# EAGLE design CoinControllerV1 (EAGLE 9.5.1)
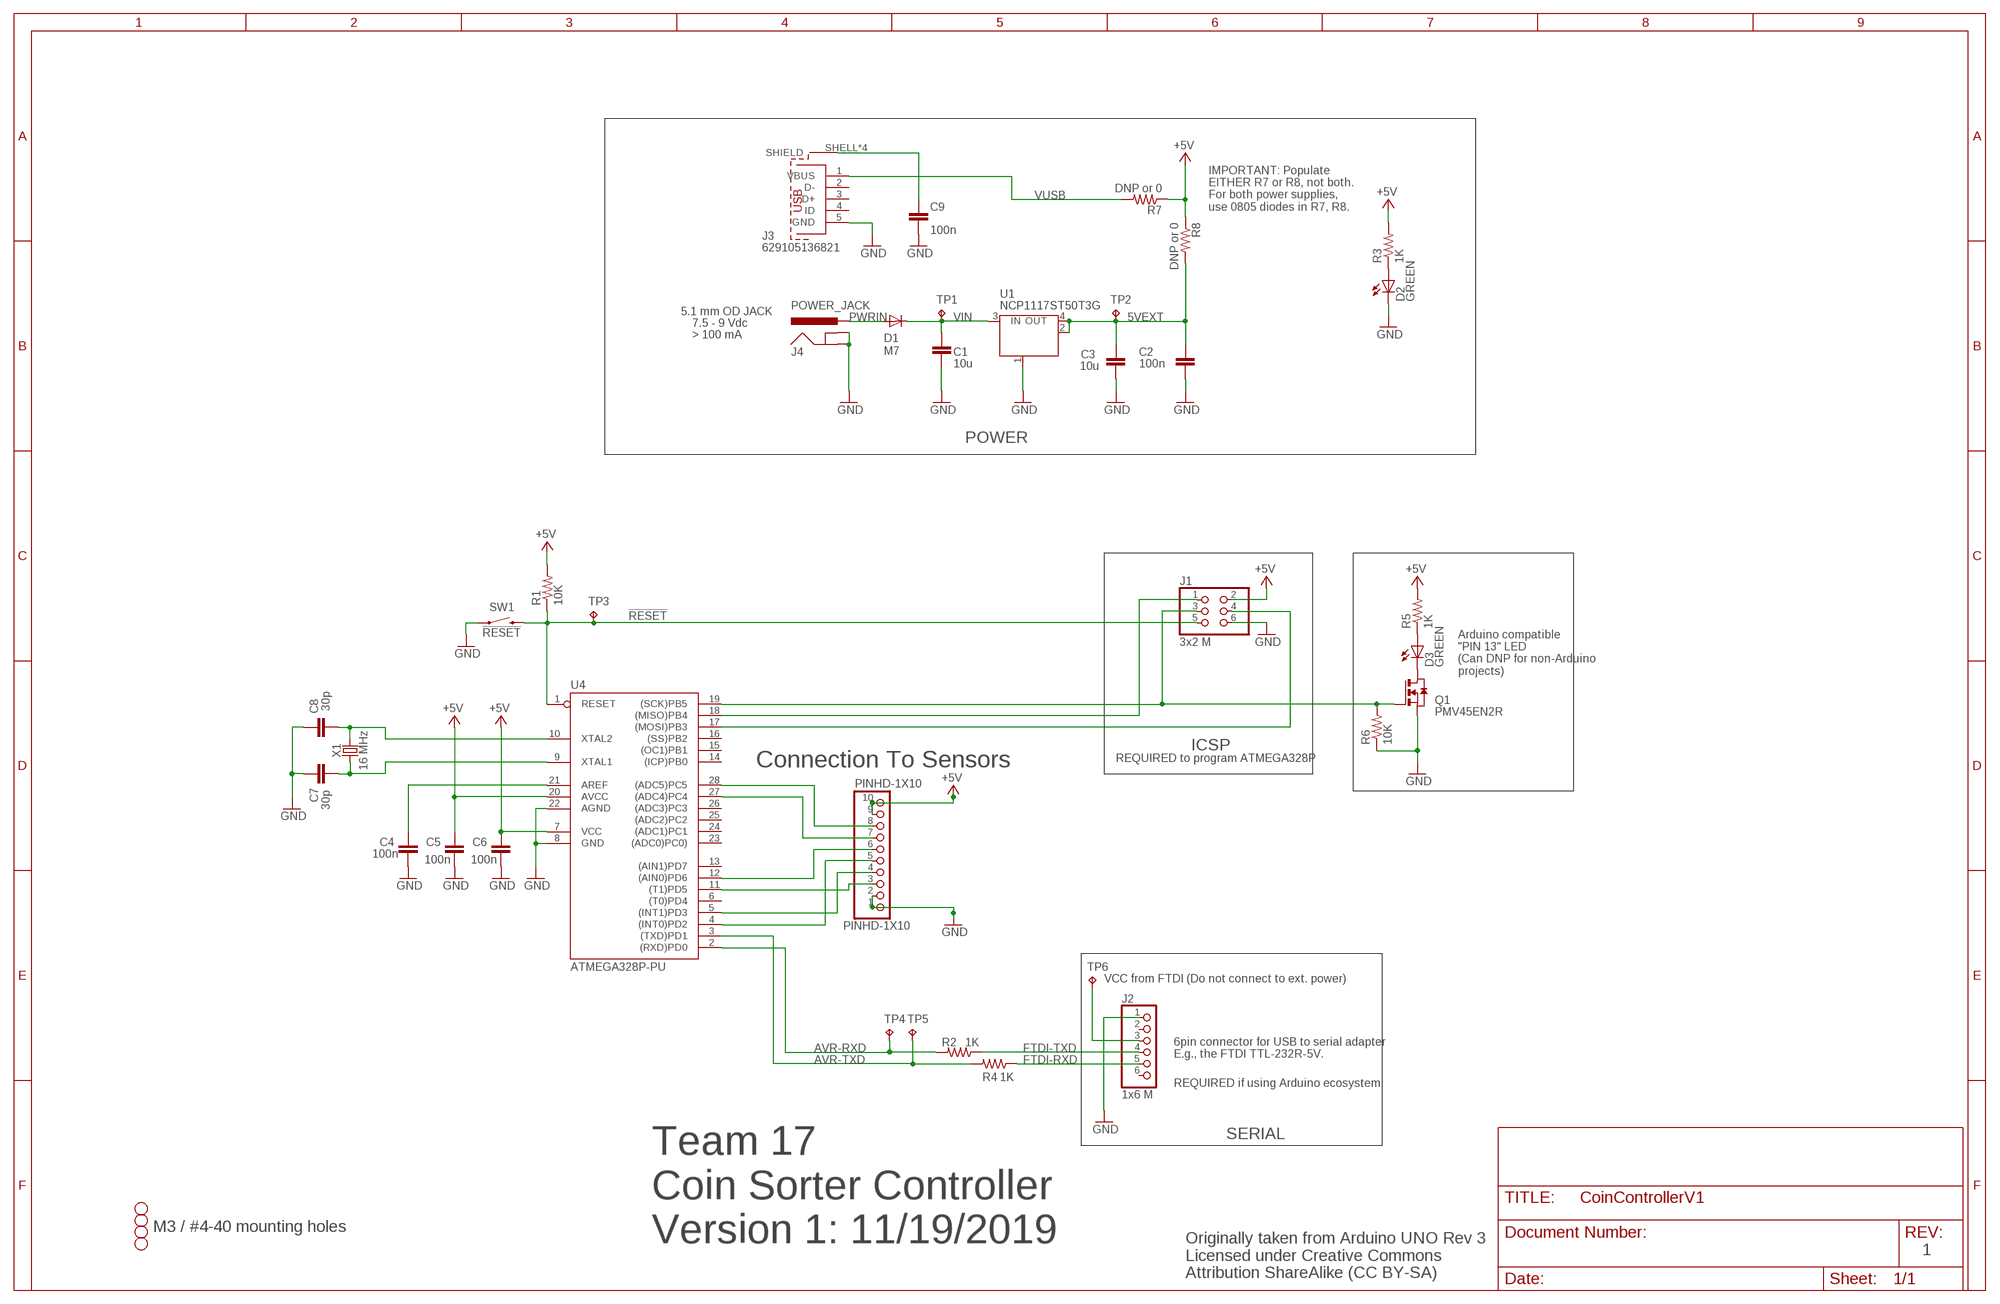
[diagram p0: schematic, sheet 1]

## Parts
C1  10u  C-EUC0805K  [C0805K]
C2  100n  C-EUC0805K  [C0805K]
C3  10u  C-EUC0805K  [C0805K]
C4  100n  C-EUC0805K  [C0805K]
C5  100n  C-EUC0805K  [C0805K]
C6  100n  C-EUC0805K  [C0805K]
C7  30p  C-EUC0805K  [C0805K]
C8  30p  C-EUC0805K  [C0805K]
C9  100n  C-EUC0805K  [C0805K]
D1  M7  DIODE-SMB  [SMB]
D2  GREEN  LEDCHIP-LED0805  [CHIP-LED0805]
D3  GREEN  LEDCHIP-LED0805  [CHIP-LED0805]
H1  STAND-OFF  [STAND-OFF]
H2  STAND-OFF  [STAND-OFF]
H3  STAND-OFF  [STAND-OFF]
H4  STAND-OFF  [STAND-OFF]
J1  3x2 M  PINHD-2X3  [2X03]
J2  1x6 M  PINHD-1X6  [1X06]
J3  629105136821  [629105136821]
J4  POWER_JACK  [POWER_JACK_PTH]
PINHD-1X10  PINHD-1X10  [1X10-BIG]
Q1  PMV45EN2R  NMOSSOT23  [SOT-23]
R1  10K  R-US_R0805  [R0805]
R2  1K  R-US_R0805  [R0805]
R3  1K  R-US_R0805  [R0805]
R4  1K  R-US_R0805  [R0805]
R5  1K  R-US_R0805  [R0805]
R6  10K  R-US_R0805  [R0805]
R7  DNP or 0  R-US_R0805  [R0805]
R8  DNP or 0  R-US_R0805  [R0805]
SW1  !RESET  SWITCH-MOMENTARY-2SMD  [TACTILE_SWITCH_SMD]
TP1  TPPAD1-13  [P1-13]
TP2  TPPAD1-13  [P1-13]
TP3  TPPAD1-13  [P1-13]
TP4  TPPAD1-13  [P1-13]
TP5  TPPAD1-13  [P1-13]
TP6  TPPAD1-13  [P1-13]
U1  NCP1117ST50T3G  MC33269ST-3.3T3  [SOT223]
U4  ATMEGA328P-PU  [DIL28-3]
X1  16 MHz  CRYSTALSMD-HC49UP  [HC49UP]

## Nets
5VEXT: C2.2 C3.1 R8.2 TP2.TP U1.2(OUT) U1.4(OUT)
!RESET: J1.5 R1.1 SW1.3 TP3.TP U4.1(RESET)
+5V: C5.2 C6.2 J1.2 PINHD-1X10.9 PINHD-1X10.10 R1.2 R3.2 R5.2 R7.1 R8.1 U4.7(VCC) U4.20(AVCC)
AVR-RXD: R2.2 TP4.TP U4.2((RXD)PD0)
AVR-TXD: R4.2 TP5.TP U4.3((TXD)PD1)
FTDI-RXD: J2.5 R4.1
FTDI-TXD: J2.4 R2.1
GND: C1.2 C2.1 C3.2 C4.1 C5.1 C6.1 C7.2 C8.2 C9.1 D2.C J1.6 J2.1 J3.5(GND) J4.GND J4.GNDBREAK PINHD-1X10.1 PINHD-1X10.2 Q1.2(S) R6.1 SW1.1 U1.1(GND/ADJ) U4.8(GND) U4.22(AGND)
MISO: J1.1 U4.18((MISO)PB4)
MOSI: J1.4 U4.17((MOSI)PB3)
N$1: C4.2 U4.21(AREF)
N$2: D3.A R5.1
N$3: D2.A R3.1
N$4: D3.C Q1.1(D)
N$5: J2.3 TP6.TP
N$6: C9.2 J3.SHELL1(SHIELD) J3.SHELL2(SHIELD) J3.SHELL3(SHIELD) J3.SHELL(SHIELD)
N$7: PINHD-1X10.5 U4.4((INT0)PD2)
N$8: PINHD-1X10.4 U4.5((INT1)PD3)
N$9: PINHD-1X10.3 U4.11((T1)PD5)
N$10: PINHD-1X10.6 U4.12((AIN0)PD6)
N$11: PINHD-1X10.7 U4.27((ADC4)PC4)
N$12: PINHD-1X10.8 U4.28((ADC5)PC5)
PWRIN: D1.A J4.PWR
SCK: J1.3 Q1.3(G) R6.2 U4.19((SCK)PB5)
VIN: C1.1 D1.C TP1.TP U1.3(IN)
VUSB: J3.1(VBUS) R7.2
XTAL1: C7.1 U4.9(XTAL1) X1.1
XTAL2: C8.1 U4.10(XTAL2) X1.2
Unconnected: J2.2 J2.6 J3.2(D-) J3.3(D+) J3.4(ID) U4.6((T0)PD4) U4.13((AIN1)PD7) U4.14((ICP)PB0) U4.15((OC1)PB1) U4.16((SS)PB2) U4.23((ADC0)PC0)) U4.24((ADC1)PC1) U4.25((ADC2)PC2) U4.26((ADC3)PC3)

## Notes on the sheet
- IMPORTANT: Populate 
  EITHER R7 or R8, not both.
  For both power supplies,
  use 0805 diodes in R7, R8.
- 5.1 mm OD JACK
- 7.5 - 9 Vdc
- > 100 mA
- POWER
- Arduino compatible
  "PIN 13" LED
  (Can DNP for non-Arduino
  projects)
- ICSP
- REQUIRED to program ATMEGA328P
- Connection To Sensors
- VCC from FTDI (Do not connect to ext. power)
- 6pin connector for USB to serial adapter
  E.g., the FTDI TTL-232R-5V.
- REQUIRED if using Arduino ecosystem.
- SERIAL
- M3 / #4-40 mounting holes
- Team 17
  Coin Sorter Controller
  Version 1: 11/19/2019
- 1
- Originally taken from Arduino UNO Rev 3
  Licensed under Creative Commons 
  Attribution ShareAlike (CC BY-SA)

## Library data of the parts
C1 C3 = rcl:C-EU: CAPACITOR, European symbol; MFR: Samsung; MPN: CL21A106KOQNNNG; SPICEPREFIX: C
C2 C4-C6 C9 = rcl:C-EU: CAPACITOR, European symbol; MFR: Samsung; MPN: CL21B104KBCNNNC; SPICEPREFIX: C
C7 = rcl:C-EU: CAPACITOR, European symbol; DESC: CAP CER 30PF 50V C0G/NP0 0805; MFR: Samsung; MPN: CL21C180JBANNNC; SPICEPREFIX: C
C8 = rcl:C-EU: CAPACITOR, European symbol; DESC: CAP CER 30PF 50V C0G/NP0 0805; MFR: Samsung; MPN: CL21C300JBANNNC; SPICEPREFIX: C
D1 = diode:DIODE-: DIODE; MFR: SMC Diode; MPN: 10BQ030TR
D2 D3 = led:LED: LED OSRAM: - CHIPLED LG R971, LG N971, LY N971, LG Q971, LY Q971, LO R971, LY R971 LH N974, LH R974 LS Q976, LO Q976, LY Q976 LO Q996 - Hyper CHIPLED LW Q18S LB Q993, LB Q99A, LB R99A - SideLED LS A670, LO A670, LY A670, LG A670, LP A670 LB A673, LV A673, LT A673, LW A673 LH A674 LY A675 LS A676, LA A676, LO A676, LY A676, LW A676 LS A679, LY A679, LG A679 - Hyper Micro SIDELED® LS Y876, LA Y876, LO Y876, LY Y876 LT Y87S - SmartLED LW L88C, LW L88S LB L89C, LB L89S, LG L890 LS L89K, LO L89K, LY L89K LS L896, LA L896, LO L896, LY L896 - TOPLED LS T670, LO T670, LY T670, LG T670, LP T670 LSG T670, LSP T670, LSY T670, LOP T670, LYG T670 LG T671, LOG T671, LSG T671 LB T673, LV T673, LT T673, LW T673 LH T674 LS T676, LA T676, LO T676, LY T676, LB T676, LH T676, LSB T676, LW T676 LB T67C, LV T67C, LT T67C, LS T67K, LO T67K, LY T67K, LW E67C LS E67B, LA E67B, LO E67B, LY E67B, LB E67C, LV E67C, LT E67C LW T67C LS T679, LY T679, LG T679 LS T770, LO T770, LY T770, LG T770, LP T770 LB T773, LV T773, LT T773, LW T773 LH T774 LS E675, LA E675, LY E675, LS T675 LS T776, LA T776, LO T776, LY T776, LB T776 LHGB T686 LT T68C, LB T68C - Hyper Mini TOPLED® LB M676 - Mini TOPLED Santana® LG M470 LS M47K, LO M47K, LY M47K Source: http://www.osram.convergy.de LUXEON: - LUMILED® LXK2-PW12-R00, LXK2-PW12-S00, LXK2-PW14-U00, LXK2-PW14-V00 LXK2-PM12-R00, LXK2-PM12-S00, LXK2-PM14-U00 LXK2-PE12-Q00, LXK2-PE12-R00, LXK2-PE12-S00, LXK2-PE14-T00, LXK2-PE14-U00 LXK2-PB12-K00, LXK2-PB12-L00, LXK2-PB12-M00, LXK2-PB14-N00, LXK2-PB14-P00, LXK2-PB14-Q00 LXK2-PR12-L00, LXK2-PR12-M00, LXK2-PR14-Q00, LXK2-PR14-R00 LXK2-PD12-Q00, LXK2-PD12-R00, LXK2-PD12-S00 LXK2-PH12-R00, LXK2-PH12-S00 LXK2-PL12-P00, LXK2-PL12-Q00, LXK2-PL12-R00 Source: www.luxeon.com KINGBRIGHT: KA-3528ASYC Source: www.kingbright.com; MFR: Würth Elektronik; MPN: 150080GS75000
H1-H4 = SparkFun-Hardware:STAND-OFF: Stand Off Drill holes for mechanically mounting via screws, standoffs, etc. Note: Use the keepout ring to avoid running the screw head into surrounding components. Variant Overviews STAND-OFF - Mechanical footprint for a #4 phillips button head screw. STAND-OFF-TIGHT - Mechanical footprint for a #4 phillips button head screw, Example SparkFun Products Screw - Phillips Head (1/4", 4-40, 10 pack) <https://www.sparkfun.com/products/10453> (PRT-10453) Screw - Phillips Head (1/2", 4-40, 10 pack) <https://www.sparkfun.com/products/10452> (PRT-10452) Screw - Phillips Head (3/4", 4-40, 10 pack) <https://www.sparkfun.com/products/10451> (PRT-10451) Screw - Phillips Head (1", 4-40, 10 pack) <https://www.sparkfun.com/products/10450> (PRT-10450)
J1 = SmartPrj:PINHD-2X3: PIN HEADER; MFR: Harwin; MPN: M20-9980345
J2 = pinhead:PINHD-1X6: PIN HEADER; MFR: Sullins; MPN: PRPC006SAAN-RC
J3 = Wurth_Elektronik_Electromechanic_Input-Output_Connectors_rev19b:629105136821: WR-COM SMT Horizontal 5 Contacts Micro USB Type B,5 pins=>Code : Con_I-O_COM_MicroUSB_629105136821 <http://katalog.we-online.de/media/images/eican/Con_I-O_COM_MicroUSB_629105136821_pf2.jpg> Details see: http://katalog.we-online.de/en/em/COM_MICRO_SMT_TYPE_B_HORIZONTAL/629105136821?m Created 2014-07-09, Karrer Zheng 2014 (C) Würth Elektronik; MFR: Wurth; MPN: 629105136821
J4 = SparkFun-Connectors:POWER_JACK: Power Jack Connector This is the standard 5.5mm barrel jack for power. The PTH is the most common, proven, reliable, footprint. The Slot footprint only works if the mill layer is transmitted to the PCB fab house so be warned. Here are the connectors we sell at SparkFun: DC Barrel Power Jack/Connector <https://www.sparkfun.com/products/119> (PRT-00119) DC Barrel Power Jack/Connector (SMD) <https://www.sparkfun.com/products/12748> (PRT-12748) DC Barrel Jack Adapter - Breadboard Compatible <https://www.sparkfun.com/products/10811> (PRT-10811) It is used on this SparkFun product (and many, many others): SparkFun RedBoard - Programmed with Arduino <https://www.sparkfun.com/products/12757> (DEV-12757) Also, if you need a mating power supply or connector, please check these out: Wall Adapter Power Supply - 9VDC 650mA <https://www.sparkfun.com/products/298> (TOL-00298) DC Barrel Jack Adapter - Male <https://www.sparkfun.com/products/10287> (PRT-10287); MFR: CUI; MPN: PJ-202A; PROD_ID: CONN-08197
PINHD-1X10 = adafruit:PINHD-1X10: Pin header 1x10 0.1" spacing With round pins
Q1 = zetex:NMOSSOT23: MOS FET; MFR: Nexperia; MPN: PMV45EN2R; OC_FARNELL: unknown; OC_NEWARK: unknown
R1 R6 = rcl:R-US_: RESISTOR, American symbol; MFR: Yageo; MPN: RC0805FR-0710KL; SPICEPREFIX: R
R2-R5 = rcl:R-US_: RESISTOR, American symbol; MFR: Yageo; MPN: RC0805FR-071KL; SPICEPREFIX: R
R7 R8 = rcl:R-US_: RESISTOR, American symbol; MFR: Yageo; MPN: RC0805JR-070RL; SPICEPREFIX: R
SW1 = SparkFun-Electromechanical:SWITCH-MOMENTARY-2: Various NO switches- pushbuttons, reed, etc; DESC: SWITCH TACTILE SPST-NO 0.05A 12V; MFR: C&K; MPN: RS-187R05A2-DS MT RT
TP1-TP6 = testpad:TP: Test pad
U1 = linear:MC33269ST*: Adjustable Output Low Dropout Voltage Regulator 800 mA Source: http://www.onsemi.com/pub/Collateral/MC33269-D.PDF; MFR: ON Semiconductor; MPN: NCP1117ST50T3G
U4 = SmartPrj:ATMEGA328P-: MICROCONTROLLER 4 Kbytes FLASH 128 bytes SRAM 256 bytes EEPROM UART 6-channel 10 bit ADC; MFR: Microchip; MPN: ATMEGA328P-PU
X1 = SparkFun-Clocks:CRYSTAL: Crystals (Generic) These are passive quartz crystals, which can be used as a clock source for a microcontroller. Crystal's are two-terminal devices. They require external "load" capacitors to generate an oscillating signal.; DESC: CRYSTAL 16.000 MHZ 18PF SMD; MFR: ECS; MPN: ECS-160-18-5PX-TR

## Net classes
0 default: width 0.254 mm, clearance 0.254 mm

## Board
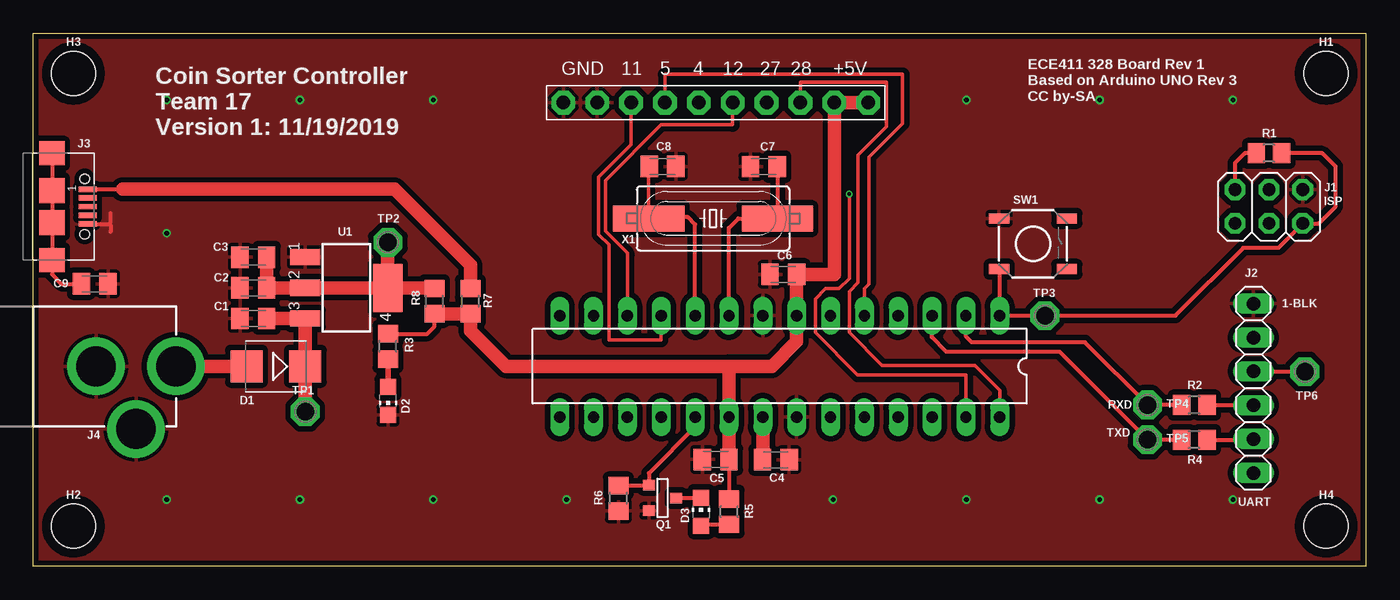
[diagram p1: board, top side]
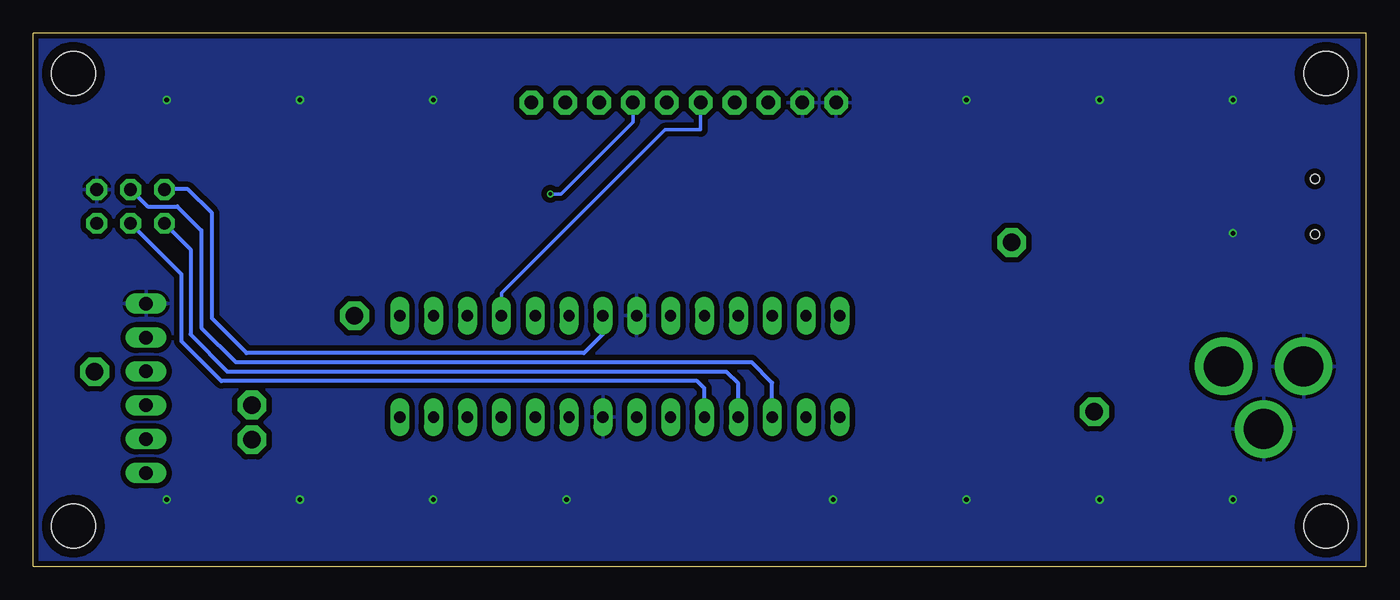
[diagram p2: board, bottom side, seen from below]

Size 100 x 40 mm. Coordinates in mm from the lower left corner, seen from the top.
Outline: 0,0 0,40 100,40 100,0 0,0
Copper layers (1*16): Top 0.035559375mm / dielectric 1.6mm / Bottom 0.035559375mm
Design rules "oshpark-2layer": minimum track width 6mil, minimum drill 10mil, track to track 6mil, track to pad 6mil, pad to pad 6mil, via to via 6mil, smd to smd 6mil, copper to edge 15mil, drill to drill 6mil, minimum pad ring 5mil, minimum via ring 5mil, stop-mask expansion 2.5mil, vias tented up to drill 0mil, thermal gap 10mil

### Footprints (pad centres in the part's own frame; a part is rotated, then mirrored left to right if it is on the bottom)
C0805K = smd 1.3 x 1.6: 1 -1,0; 2 1,0
SMB = smd 2.4 x 2.4: A 2.2,0; C -2.2,0
CHIP-LED0805 = smd 1.2 x 1.2: A 0,-1.05; C 0,1.05
STAND-OFF = hole 3.302: 0,0
2X03 = drill 0.95 pad 1.55 octagon: 1 -2.54,-1.27; 2 -2.54,1.27; 3 0,-1.27; 4 0,1.27; 5 2.54,-1.27; 6 2.54,1.27
1X06 = drill 1.016 long: 1 -6.35,0; 2 -3.81,0; 3 -1.27,0; 4 1.27,0; 5 3.81,0; 6 6.35,0
629105136821 = smd 0.4 x 1.35: 1 -1.3,2.675; 2 -0.65,2.675; 3 0,2.675; 4 0.65,2.675; 5 1.3,2.675 | smd 1.8 x 1.9: SHELL -4,0; SHELL3 4,0 | smd 1.9 x 1.9: SHELL1 -1.2,0; SHELL2 1.2,0 | hole 0.7: -2.075,2.45; 2.075,2.45
POWER_JACK_PTH = drill 2.997 pad 4.318: GND 0,7.7; GNDBREAK 4.7,10.7; PWR 0,13.7
1X10-BIG = drill 1.016 pad 1.778 octagon: 1 -11.43,0; 2 -8.89,0; 3 -6.35,0; 4 -3.81,0; 5 -1.27,0; 6 1.27,0; 7 3.81,0; 8 6.35,0; 9 8.89,0; 10 11.43,0
SOT-23 = smd 0.787 x 0.889: 1 0.025,-1.016; 2 -0.94,1.016; 3 0.991,1.016
R0805 = smd 1.3 x 1.5: 1 -0.95,0; 2 0.95,0
TACTILE_SWITCH_SMD = smd 1.524 x 0.762: 1 -2.54,1.905; 2 2.54,1.905; 3 -2.54,-1.905; 4 2.54,-1.905
P1-13 = drill 1.321 pad 2.159 octagon: TP 0,0
SOT223 = smd 1.219 x 2.235: 1 -2.311,-3.099; 2 0,-3.099; 3 2.311,-3.099 | smd 3.6 x 2.2: 4 0,3.099
DIL28-3 = drill 0.85 pad 1.422 long: 1 -16.51,-3.81; 2 -13.97,-3.81; 3 -11.43,-3.81; 4 -8.89,-3.81; 5 -6.35,-3.81; 6 -3.81,-3.81; 7 -1.27,-3.81; 8 1.27,-3.81; 9 3.81,-3.81; 10 6.35,-3.81; 11 8.89,-3.81; 12 11.43,-3.81; 13 13.97,-3.81; 14 16.51,-3.81; 15 16.51,3.81; 16 13.97,3.81; 17 11.43,3.81; 18 8.89,3.81; 19 6.35,3.81; 20 3.81,3.81; 21 1.27,3.81; 22 -1.27,3.81; 23 -3.81,3.81; 24 -6.35,3.81; 25 -8.89,3.81; 26 -11.43,3.81; 27 -13.97,3.81; 28 -16.51,3.81
HC49UP = smd 5.334 x 1.93: 1 -4.826,0; 2 4.826,0

### Placement (x,y rotation side)
C1  16.5,18.6 180 top
C2  16.5,20.9 0 top
C3  16.5,23.2 180 top
C4  55.7,8 180 top
C5  51.19,8.01 0 top
C6  56.27,21.91 0 top
C7  54.8,30 180 top
C8  47.2,30.01 0 top
C9  4.6,21.2 180 top
D1  18.2,15 180 top
D2  26.6,12.4 180 top
D3  50.1,4.1 0 top
H1  97,37 0 top
H2  3,3 0 top
H3  3,37 0 top
H4  97,3 0 top
J1  92.7,27 0 top
J2  91.54,13.35 270 top
J3  1.4,27 270 top
J4  -3,15 270 top
PINHD-1X10  51.2,34.8 0 top
Q1  47.2,5.1 90 top
R1  92.7,31 180 top
R2  87.1,12.1 180 top
R3  26.6,16.5 90 top
R4  87.1,9.5 180 top
R5  52.2,4.1 90 top
R6  43.9,5.1 90 top
R7  32.8,19.9 90 top
R8  30.1,19.9 90 top
SW1  75,24.2 0 top
TP1  20.4,11.6 0 top
TP2  26.6,24.3 0 top
TP3  75.9,18.8 0 top
TP4  83.6,12.1 0 top
TP5  83.6,9.5 0 top
TP6  95.4,14.6 0 top
U1  23.5,20.9 270 top
U4  56,15 180 top
X1  51,26.1 180 top

### Tracks (layer width: path | path; a pad name or v marks a point on that pad's centre or on a via)
5VEXT
  Top 0.3: TP2.TP
  Top 1: C3.1 C2.2 U1.2 U1.4 | U1.4 TP2.TP | U1.4 30.05,20.9 R8.2
!RESET
  Top 0.254: TP3.TP
  Top 0.3: R1.1 96.7,31 97.7,30 97.7,27 96.43,25.73 J1.5 93.41,23.9 90.78,23.9 85.69,18.81 TP3.TP U4.1 72.51,22.25 SW1.3
+5V
  Top 0.3: R1.2 90.9,31 90.16,30.26 J1.2 | C5.2 R5.2 | R3.2 29.55,17.45 30.1,18 R8.1
  Top 1: C6.2 U4.7 57.27,16.87 55.4,15 52.2,15 | C6.2 | 52.2,15 35.46,15 32.8,17.66 R7.1 R8.1 | 52.2,15 52.19,14.99 U4.20 C5.2 | PINHD-1X10.10 PINHD-1X10.9 60.09,21.91 60.1,21.9 C6.2
  Bottom 0.3: U4.7 57.27,17.43 58.7,16 84,16 86.6,18.6 86.6,26.5 88.4,28.3 90.13,28.3 J1.2
AVR-RXD
  Top 0.3: R2.2 TP4.TP 78.9,16.8 70.4,16.8 69.97,17.23 U4.2
AVR-TXD
  Top 0.3: R4.2 TP5.TP 77,16.1 68.5,16.1 67.4,17.2 67.4,18.78 U4.3
FTDI-RXD
  Top 0.3: R4.1 91.5,9.5 J2.5
FTDI-TXD
  Top 0.3: J2.4 88.07,12.08 R2.1
GND  (via drill 0.35)
  Top 0.3: J3.5 5.7,25.7 | 5.7,25.7 5.8,25.8 5.8,26.5 | 5.7,25.7 5.8,25.6 5.8,25.1
  other vias: 20,5 30,5 40,5 10,5 10,25 10,35 20,35 30,35 70,35 80,35 90,35 70,5 60,5 80,5 90,5
  pour Bottom (isolate 0.406, rank 2): 0,40 100,40 100,0 0,0
  pour Top (isolate 0.406, rank 2): 0,40 100,40 100,0 0,0
MISO
  Bottom 0.3: U4.18 47.11,13.71 48,14.6 85.4,14.6 88.2,17.4 88.2,23.77 J1.1
MOSI
  Bottom 0.3: U4.17 44.57,13.77 46.1,15.3 84.8,15.3 87.4,17.9 87.4,25.2 89.2,27 91.43,27 J1.4
N$1
  Top 0.5: 54.73,8.03 C4.2
  Top 1: U4.21 54.73,8.03
N$2
  Top 0.3: D3.A 50.2,3.15 R5.1
N$3
  Top 0.4: R3.1 D2.A
N$4
  Top 0.3: Q1.1 50.08,5.12 D3.C
N$5
  Top 0.3: J2.3 95.38,14.62 TP6.TP
N$6
  Top 0.3: J3.SHELL J3.SHELL1 J3.SHELL2 J3.SHELL3 1.4,21.9 2.1,21.2 C9.2
N$7
  Bottom 0.254: U4.4 64.87,18.85 64.87,20.52 52.62,32.77 49.94,32.77 PINHD-1X10.5
N$8
  Top 0.254: U4.5 62.35,20.86 62.68,21.19 62.68,30.7 65.22,33.24 65.22,36.93 47.39,36.93 PINHD-1X10.4
N$9
  Top 0.254: U4.11 47.11,16.96 43.18,16.96 43.18,24.13 42.42,24.89 42.42,29.21 44.85,31.64 PINHD-1X10.3
N$10
  Top 0.254: U4.12 44.57,23.3 44.58,23.3 44.58,23.5 42.93,25.15 42.93,28.96 47.1,33.13 52.47,33.13 PINHD-1X10.6
N$11  (via drill 0.25)
  Top 0.254: v61.21,27.94 61.21,21.59 60.45,20.83 59.44,20.83 58.67,20.07 58.67,17.53 61.84,14.36 69.97,14.36 U4.27
  Bottom 0.254: v61.21,27.94 60.41,27.94 55.02,33.34 PINHD-1X10.7
N$12
  Top 0.254: U4.28 72.51,13.21 70.66,15.06 63.68,15.06 61.21,17.53 61.21,20.63 61.88,21.29 61.88,30.86 64.01,32.99 64.01,36.32 57.55,36.32 PINHD-1X10.8
PWRIN
  Top 1: D1.A J4.PWR
SCK
  Top 0.3: U4.19 49.65,10.45 46.18,6.98 Q1.3 46.14,6.05 R6.2
  Bottom 0.3: U4.19 49.65,13.35 50.2,13.9 85.9,13.9 88.9,16.9 88.9,21.93 J1.3
VIN
  Top 1: TP1.TP D1.C U1.3 C1.1
VUSB
  Top 0.3: J3.1 6.7,28.3
  Top 1: 6.7,28.3 27.1,28.3 32.8,22.6 R7.2
XTAL1
  Top 0.254: C7.1 55.83,29.97
  Top 0.3: 55.83,29.97 X1.1 52.9,26.1 52.19,25.39 U4.9
XTAL2
  Top 0.254: C8.1 46.17,29.98 X1.2 46.27,26.2
  Top 0.3: 46.27,26.2 49.1,26.2 49.65,25.65 U4.10

### Text on the board
tPlace: ISP | 1-BLK | RXD | TXD | UART
tNames: GND | 11 | 5 | 4 | 12 | 27 | 28 | +5V | ECE411 328 Board Rev 1 / Based on Arduino UNO Rev 3 / CC by-SA | Coin Sorter Controller / Team 17 / Version 1: 11/19/2019
214bmp: D:/SmartProjects/Snc/a4_bn_logo2.bmp